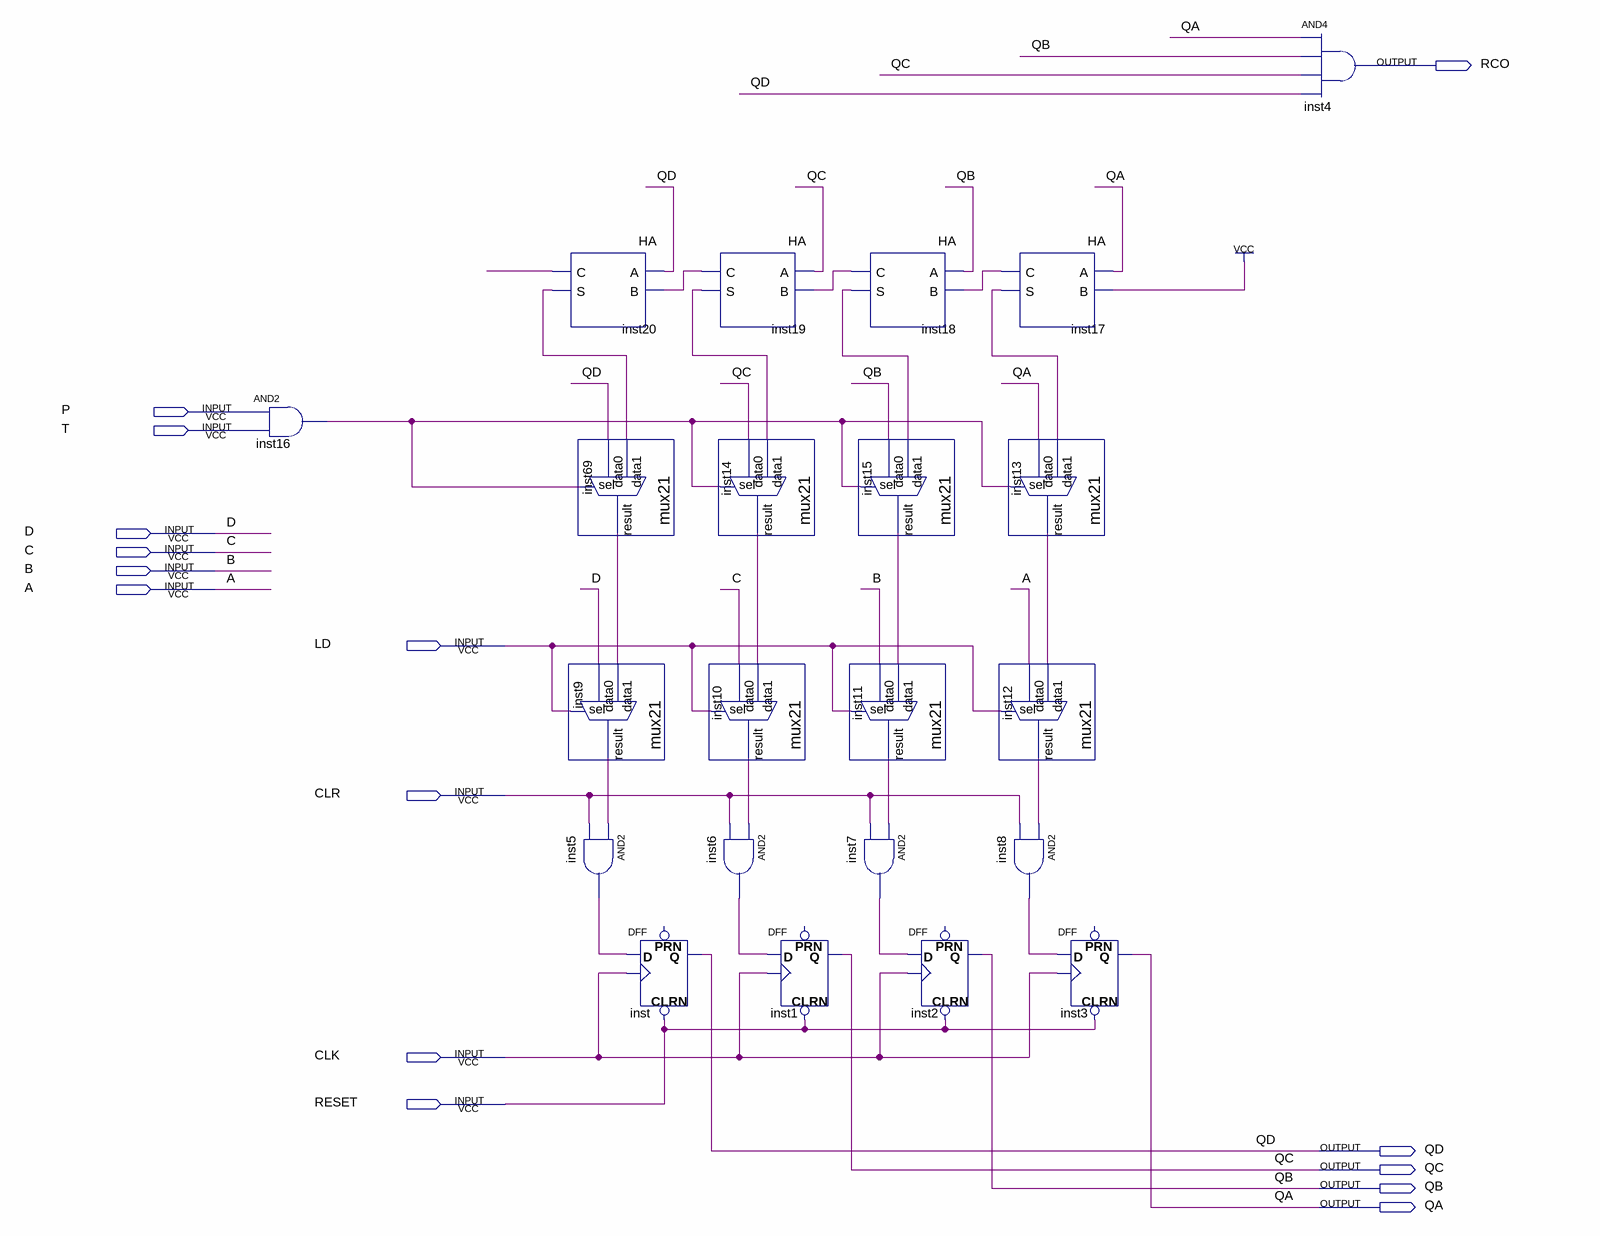
[diagram p0: schematic sheet]
// Quartus schematic 163.bdf as structural Verilog: 22 symbols, 15 pins
module \163  (
  input  P,
  input  T,
  input  D,
  input  C,
  input  B,
  input  A,
  input  LD,
  input  CLR,
  input  CLK,
  input  RESET,
  output RCO,
  output QD,
  output QC,
  output QB,
  output QA
);

  wire inst5_out, inst6_out, inst7_out, inst8_out, inst9_result, inst10_result, inst11_result, inst12_result,
       inst13_result, inst14_result, inst15_result, inst16_out, inst17_c, inst17_s, inst18_c, inst18_s,
       inst19_c, inst19_s, inst20_c, inst20_s, inst69_result;

  and inst16 (inst16_out, P, T);
  HA inst20 (.A(QD), .B(inst19_c), .C(inst20_c), .S(inst20_s));
  mux21 inst9 (.data1(inst69_result), .data0(D), .sel(LD), .result(inst9_result));
  and inst5 (inst5_out, inst9_result, CLR);
  mux21 inst69 (.data1(inst20_s), .data0(QD), .sel(inst16_out), .result(inst69_result));
  DFF inst (.CLRN(RESET), .CLK(CLK), .D(inst5_out), .Q(QD));  // open: PRN
  HA inst19 (.A(QC), .B(inst18_c), .C(inst19_c), .S(inst19_s));
  mux21 inst14 (.data1(inst19_s), .data0(QC), .sel(inst16_out), .result(inst14_result));
  mux21 inst10 (.data1(inst14_result), .data0(C), .sel(LD), .result(inst10_result));
  and inst6 (inst6_out, inst10_result, CLR);
  DFF inst1 (.CLRN(RESET), .CLK(CLK), .D(inst6_out), .Q(QC));  // open: PRN
  HA inst18 (.A(QB), .B(inst17_c), .C(inst18_c), .S(inst18_s));
  mux21 inst15 (.data1(inst18_s), .data0(QB), .sel(inst16_out), .result(inst15_result));
  mux21 inst11 (.data1(inst15_result), .data0(B), .sel(LD), .result(inst11_result));
  and inst7 (inst7_out, inst11_result, CLR);
  DFF inst2 (.CLRN(RESET), .CLK(CLK), .D(inst7_out), .Q(QB));  // open: PRN
  HA inst17 (.A(QA), .B(1'b1), .C(inst17_c), .S(inst17_s));
  mux21 inst13 (.data1(inst17_s), .data0(QA), .sel(inst16_out), .result(inst13_result));
  mux21 inst12 (.data1(inst13_result), .data0(A), .sel(LD), .result(inst12_result));
  and inst8 (inst8_out, inst12_result, CLR);
  DFF inst3 (.CLRN(RESET), .CLK(CLK), .D(inst8_out), .Q(QA));  // open: PRN
  and inst4 (RCO, QA, QB, QC, QD);
endmodule
